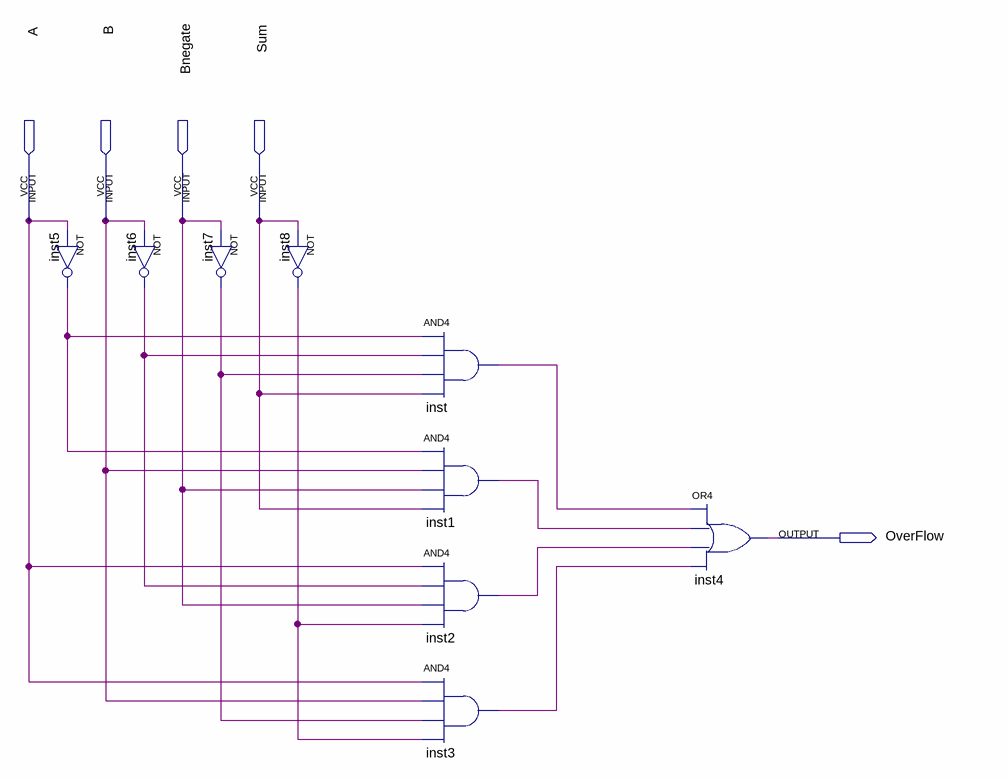
[diagram p0: schematic sheet]
// Quartus schematic OverFlow.bdf as structural Verilog: 9 symbols, 5 pins
module OverFlow (
  input  A,
  input  B,
  input  Bnegate,
  input  Sum,
  output OverFlow
);

  wire inst1_out, inst2_out, inst3_out, inst5_out, inst6_out, inst7_out, inst8_out, inst_out;

  not inst5 (inst5_out, A);
  not inst6 (inst6_out, B);
  not inst7 (inst7_out, Bnegate);
  not inst8 (inst8_out, Sum);
  and inst (inst_out, inst5_out, inst6_out, inst7_out, Sum);
  and inst1 (inst1_out, inst5_out, B, Bnegate, Sum);
  and inst2 (inst2_out, A, inst6_out, Bnegate, inst8_out);
  and inst3 (inst3_out, A, B, inst7_out, inst8_out);
  or inst4 (OverFlow, inst_out, inst1_out, inst2_out, inst3_out);
endmodule
